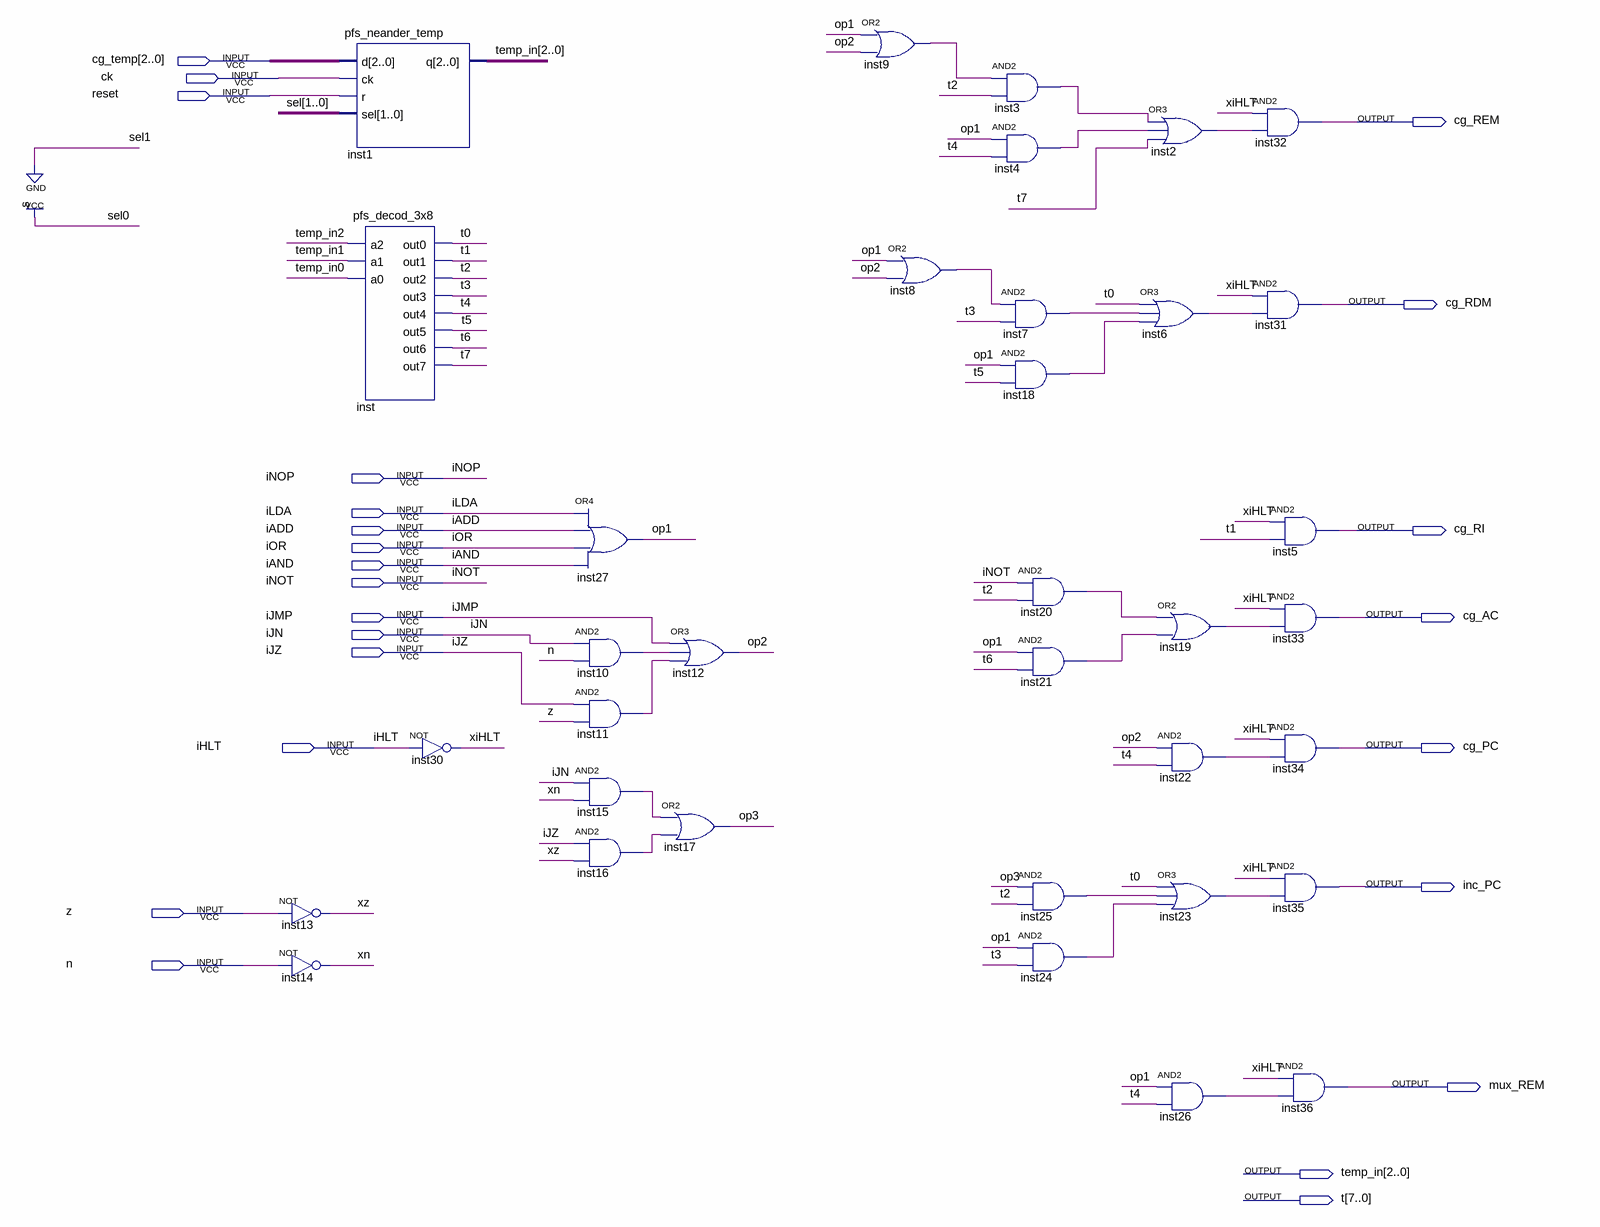
[diagram p0: schematic sheet]
// Quartus schematic pfs_neander_control.bdf as structural Verilog: 35 symbols, 24 pins
module pfs_neander_control (
  input  [2:0] cg_temp,
  input  ck,
  input  reset,
  input  iNOP,
  input  iLDA,
  input  iADD,
  input  iOR,
  input  iAND,
  input  iNOT,
  input  iJMP,
  input  iJN,
  input  iJZ,
  input  iHLT,
  input  z,
  input  n,
  output cg_REM,
  output cg_RDM,
  output cg_RI,
  output cg_AC,
  output cg_PC,
  output inc_PC,
  output mux_REM,
  output [2:0] temp_in,
  output [7:0] t
);

  wire inst2_out, inst3_out, inst4_out, inst6_out, inst7_out, inst8_out, inst9_out, inst10_out, inst11_out,
       inst15_out, inst16_out, inst18_out, inst19_out, inst20_out, inst21_out, inst22_out, inst23_out,
       inst24_out, inst25_out, inst26_out, op1, op2, op3, xiHLT, xn, xz;

  not inst13 (xz, z);
  not inst14 (xn, n);
  pfs_neander_temp inst1 (.d(cg_temp), .ck(ck), .r(reset), .sel(2'b01), .q(temp_in));
  pfs_decod_3x8 inst (
    .a2(temp_in[2]), .a1(temp_in[1]), .a0(temp_in[0]), .out0(t[0]), .out1(t[1]), .out2(t[2]), .out3(t[3]),
    .out4(t[4]), .out5(t[5]), .out6(t[6]), .out7(t[7]));
  not inst30 (xiHLT, iHLT);
  or inst27 (op1, iLDA, iADD, iOR, iAND);
  and inst10 (inst10_out, iJN, n);
  and inst11 (inst11_out, iJZ, z);
  and inst15 (inst15_out, iJN, xn);
  and inst16 (inst16_out, iJZ, xz);
  or inst12 (op2, iJMP, inst10_out, inst11_out);
  or inst17 (op3, inst15_out, inst16_out);
  or inst9 (inst9_out, op1, op2);
  or inst8 (inst8_out, op1, op2);
  and inst3 (inst3_out, inst9_out, t[2]);
  and inst4 (inst4_out, op1, t[4]);
  and inst7 (inst7_out, inst8_out, t[3]);
  and inst18 (inst18_out, op1, t[5]);
  and inst20 (inst20_out, iNOT, t[2]);
  and inst21 (inst21_out, op1, t[6]);
  and inst25 (inst25_out, op3, t[2]);
  and inst24 (inst24_out, op1, t[3]);
  or inst2 (inst2_out, inst3_out, inst4_out, t[7]);
  or inst6 (inst6_out, t[0], inst7_out, inst18_out);
  or inst19 (inst19_out, inst20_out, inst21_out);
  and inst22 (inst22_out, op2, t[4]);
  or inst23 (inst23_out, t[0], inst25_out, inst24_out);
  and inst26 (inst26_out, op1, t[4]);
  and inst32 (cg_REM, xiHLT, inst2_out);
  and inst31 (cg_RDM, xiHLT, inst6_out);
  and inst5 (cg_RI, xiHLT, t[1]);
  and inst33 (cg_AC, xiHLT, inst19_out);
  and inst34 (cg_PC, xiHLT, inst22_out);
  and inst35 (inc_PC, xiHLT, inst23_out);
  and inst36 (mux_REM, xiHLT, inst26_out);
endmodule
